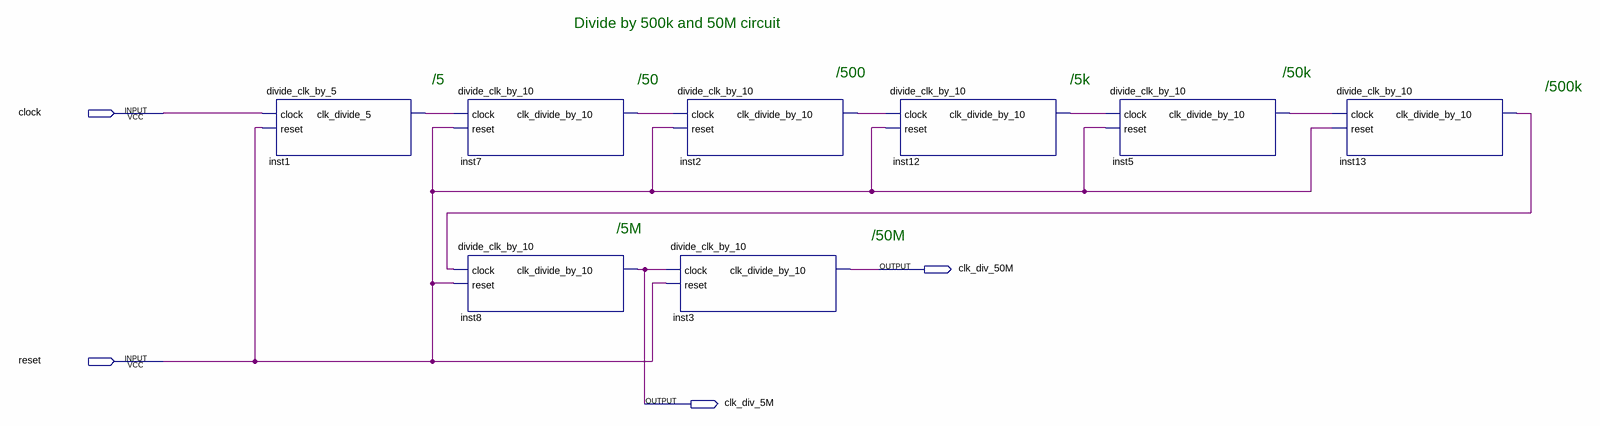
[diagram p0: schematic sheet]
// Quartus schematic divide_clk_by_50M.bdf as structural Verilog: 8 symbols, 4 pins
module divide_clk_by_50M (
  input  clock,
  input  reset,
  output clk_div_50M,
  output clk_div_5M
);

  wire inst1_clk_divide_5, inst2_clk_divide_by_10, inst5_clk_divide_by_10, inst7_clk_divide_by_10,
       inst12_clk_divide_by_10, inst13_clk_divide_by_10;

  divide_clk_by_5 inst1 (.clock(clock), .reset(reset), .clk_divide_5(inst1_clk_divide_5));
  divide_clk_by_10 inst7 (.clock(inst1_clk_divide_5), .reset(reset), .clk_divide_by_10(inst7_clk_divide_by_10));
  divide_clk_by_10 inst8 (.clock(inst13_clk_divide_by_10), .reset(reset), .clk_divide_by_10(clk_div_5M));
  divide_clk_by_10 inst2 (.clock(inst7_clk_divide_by_10), .reset(reset), .clk_divide_by_10(inst2_clk_divide_by_10));
  divide_clk_by_10 inst3 (.clock(clk_div_5M), .reset(reset), .clk_divide_by_10(clk_div_50M));
  divide_clk_by_10 inst12 (.clock(inst2_clk_divide_by_10), .reset(reset), .clk_divide_by_10(inst12_clk_divide_by_10));
  divide_clk_by_10 inst5 (.clock(inst12_clk_divide_by_10), .reset(reset), .clk_divide_by_10(inst5_clk_divide_by_10));
  divide_clk_by_10 inst13 (.clock(inst5_clk_divide_by_10), .reset(reset), .clk_divide_by_10(inst13_clk_divide_by_10));

  // Notes on the sheet:
  //   Divide by 500k and 50M circuit     
  //   /500
  //   /50k 
  //   /5
  //   /50
  //   /5k 
  //   /500k
  //   /5M
  //   /50M
endmodule
